# Altium project lpedt_project_board_cubit.PrjPcb (part 4 of 4)

## Sheet Mag_Enc_Sensors.SchDoc
size Letter; SheetNumber: 6; SheetTotal: 8
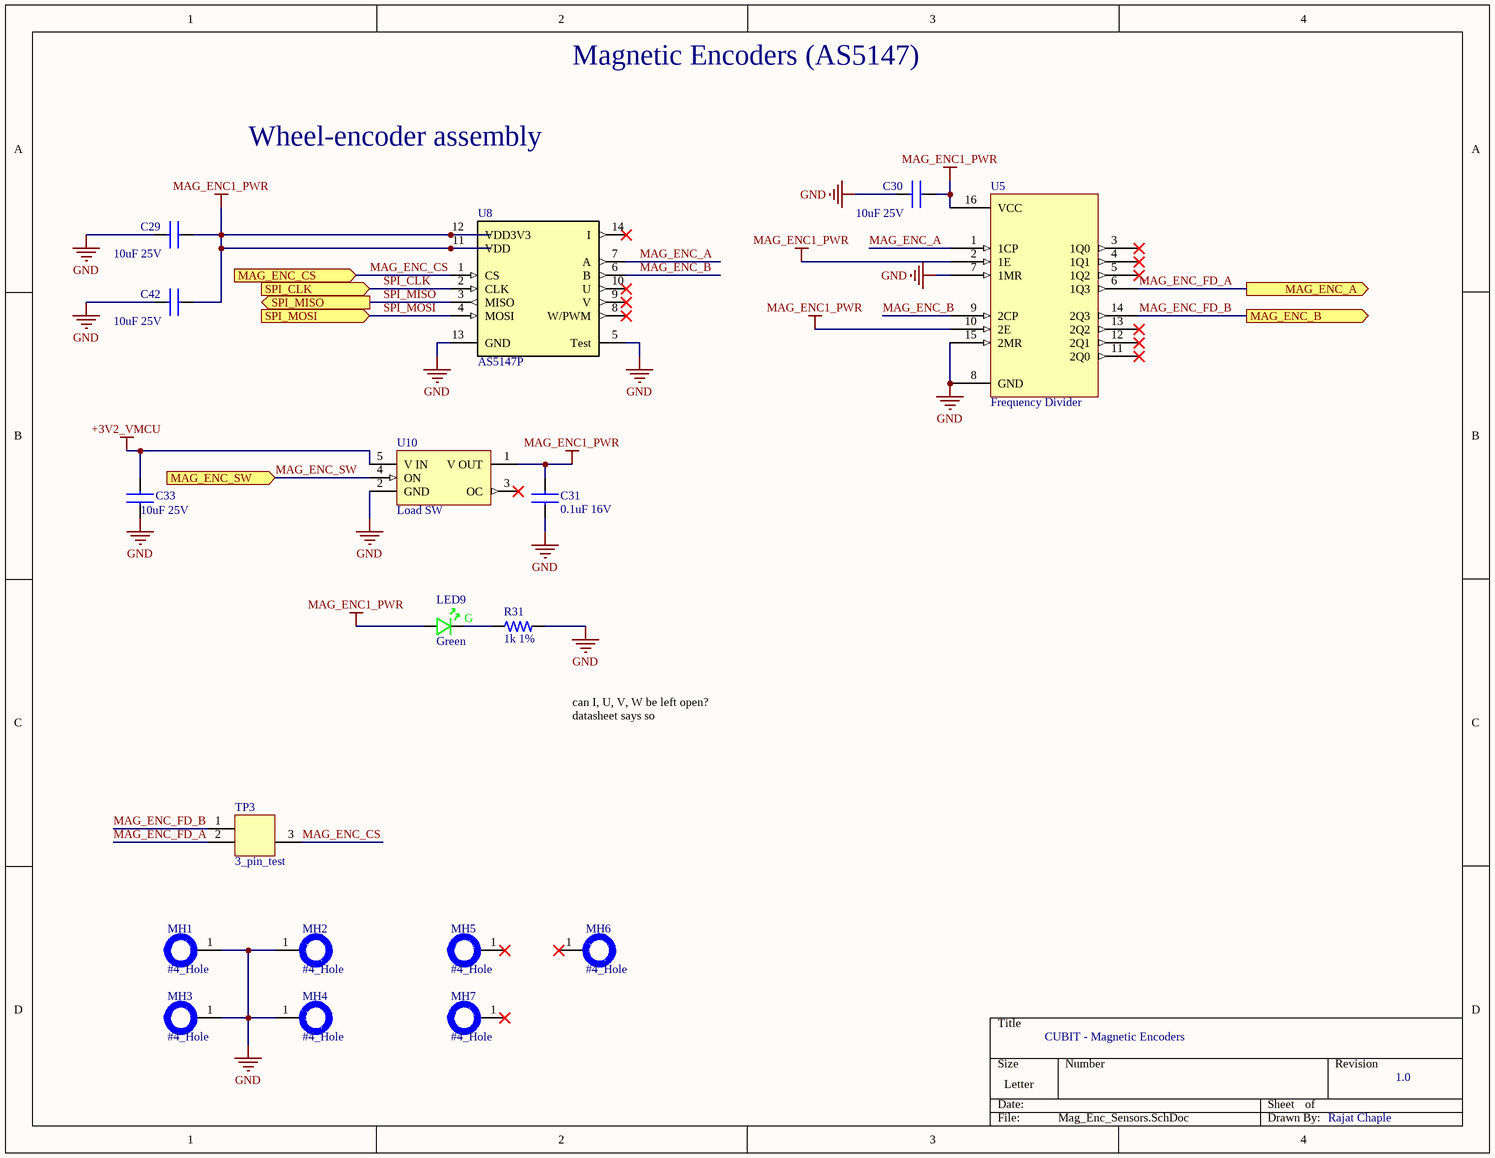
[diagram p5: Mag_Enc_Sensors.SchDoc]

### Parts
C29  10uF 25V  [CAP_0805_02X125]
C30  10uF 25V  [CAP_0805_02X125]
C31  0.1uF 16V  [CAP_0603_1MM]
C33  10uF 25V  [CAP_0805_02X125]
C42  10uF 25V  [CAP_0805_02X125]
LED9  Green  [LED_0603_RED_WL-SMCW]
MH1  #4_Hole  [HOLE_#4]
MH2  #4_Hole  [HOLE_#4]
MH3  #4_Hole  [HOLE_#4]
MH4  #4_Hole  [HOLE_#4]
MH5  #4_Hole  [HOLE_#4]
MH6  #4_Hole  [HOLE_#4]
MH7  #4_Hole  [HOLE_#4]
R31  1k 1%  [2_Chip_0603_RMCF]
TP3  3_pin_test  [3_PIN_100mil]
U5  Frequency Divider  [SOIC127P600X175-16N]
U8  AS5147P  [14-TSOP_5x4_4]
U10  Load SW  [SOT65P210X110-5N]

### Ports
MAG_ENC_A (out), MAG_ENC_B (out), MAG_ENC_CS (in), MAG_ENC_SW (in), SPI_CLK (in), SPI_MISO (out), SPI_MOSI (in)

### Nets
+3V2_VMCU: C33.1 U10.5(V_IN)
GND: C29.2 C30.2 C31.2 C33.2 C42.2 MH1.1 MH2.1 MH3.1 MH4.1 R31.2 U5.7(1MR) U5.8(GND) U5.15(2MR) U8.5(Test) U8.13(GND) U10.2(GND)
MAG_ENC1_PWR: C29.1 C30.1 C31.1 C42.1 LED9.A U5.2(1E) U5.10(2E) U5.16(VCC) U8.11(VDD) U8.12(VDD3V3) U10.1(V_OUT)
MAG_ENC_A: U5.1(1CP) U8.7(A)
MAG_ENC_B: U5.9(2CP) U8.6(B)
MAG_ENC_CS: TP3.3 U8.1(CS) ; port MAG_ENC_CS
MAG_ENC_FD_A: TP3.2 U5.6(1Q3) ; port MAG_ENC_A
MAG_ENC_FD_B: TP3.1 U5.14(2Q3) ; port MAG_ENC_B
MAG_ENC_SW: U10.4(ON) ; port MAG_ENC_SW
SPI_CLK: U8.2(CLK) ; port SPI_CLK
SPI_MISO: U8.3(MISO) ; port SPI_MISO
SPI_MOSI: U8.4(MOSI) ; port SPI_MOSI
NetLED9_C: LED9.C R31.1

Not connected (* = marked no-connect by the designer): MH5 1*; MH6 1*; MH7 1*; U5 3(1Q0)* 4(1Q1)* 5(1Q2)* 11(2Q0)* 12(2Q1)* 13(2Q2)*; U8 8(W/PWM)* 9(V)* 10(U)* 14(I)*; U10 3(OC)*

### Notes on the sheet
- Magnetic Encoders (AS5147)
- Wheel-encoder assembly
- can I, U, V, W be left open?
  datasheet says so
- CUBIT - Magnetic Encoders
- 1.0
- Rajat Chaple
- (in symbol QBLP601-AG1) G

### Library data of the parts
C29 C30 C33 C42 = GRM21BR61E106KA73K: Cap 0805 25 V 10 uF ±20% Tolerance X5R Monolithic Ceramic Chip Capacitor; Manufacturer: Murata; Tolerance: 10%; Supplier 1: Digi-Key; Manufacturer Part Number: GRM21BR61E106KA73K; RoHS: Yes; Category: Ceramic Capacitors; Stock 1: 1875; Pricing 1: 1=0.23000, 10=0.15700, 50=0.09400, 100=0.07940, 500=0.05434, 1000=0.04807, 2500=0.04598, 5000=0.04180 (USD); Mount: Surface Mount; Case/Package: 0805; Weight: 0.000335oz; Min Operating Temperature: -55°C; Max Operating Temperature: 85°C; Packaging: Tape and Reel; Capacitance: 10uF; Voltage Rating: 25V; Package Quantity: 10000; Dielectric: X5R; Voltage Rating (DC): 25V; Length: 0.079inch; Width: 0.049inch; Thickness: 0.055inch; RoHS Compliant: Yes; ComponentLink1URL: http://www.mouser.com/ds/2/281/c02e-2905.pdf?src-supplier=Mouser; ComponentLink1Description: http://www.mouser.com/ds/2/281/c02e-2905.pdf?src-supplier=Mouser; ComponentLink2URL: http://search.murata.co.jp/Ceramy/image/img/A01X/G101/ENG/GRM21BR61E106KA73-01.pdf?src-supplier=Digi-Key; ComponentLink2Description: http://search.murata.co.jp/Ceramy/image/img/A01X/G101/ENG/GRM21BR61E106KA73-01.pdf?src-supplier=Digi-Key; ComponentLink3URL: https://search.murata.co.jp/Ceramy/image/img/A01X/G101/ENG/GRM21BR61E106KA73-01.pdf?src-supplier=Digi-Key; ComponentLink3Description: https://search.murata.co.jp/Ceramy/image/img/A01X/G101/ENG/GRM21BR61E106KA73-01.pdf?src-supplier=Digi-Key
C31 = C0805C104K4RACAUTO: Cap Ceramic 0.1uF 16V X7R 10% SMD 0603 125°C Paper T/R; Manufacturer: KEMET; Capacitance: 100nF; Supplier 1: Digi-Key; Manufacturer Part Number: C0805C104K4RACAUTO; RoHS: Yes; Category: Ceramic Capacitors; Stock 1: 15900; Pricing 1: 1=0.24000, 10=0.16200, 50=0.09700, 100=0.08190, 500=0.05606, 1000=0.04959 (USD); Case/Package: 0805; Min Operating Temperature: -55°C; Max Operating Temperature: 125°C; Tolerance: 10%; Packaging: Tape and Reel; Dielectric: X7R; Length: 2mm; Depth: 1.25mm; RoHS Compliant: Yes; ComponentLink1URL: http://components.arrow.com/part/dataview/0323_00325188?src-supplier=Arrow+Europe; ComponentLink1Description: http://components.arrow.com/part/dataview/0323_00325188?src-supplier=Arrow+Europe
LED9 = QBLP601-AG1: Led Green Clear 0603 SMD; Manufacturer: QT-Brightek; Supplier 1: Digi-Key; Manufacturer Part Number: QBLP601-AG1; RoHS: No; Stock 1: 5990; Pricing 1: 1=0.35000, 10=0.19000, 100=0.08820, 500=0.08140, 1000=0.06377, 2000=0.06242 (USD)
MH1-MH7 = Mechanical_Hole
R31 = RMCF0603FT1K00: Res 1K Ohm 1% 0.1W(1/10W) ±100ppm/C Pad SMD Automotive T/R; Manufacturer: Stackpole Electronics; Resistance: 1kR; Power Rating: 100mW; Temperature Coefficient: 100ppm/°C; Supplier 1: Digi-Key; Manufacturer Part Number: RMCF0603FT1K00; RoHS: Yes; Category: Chip SMD Resistors; Pricing 1: 1=0.10000, 10=0.01700, 100=0.00680, 1000=0.00305, 2500=0.00264 (USD); Mount: Surface Mount; Case/Package: 0603; Case Code (Metric): 1608; Case Code (Imperial): 0603; Contact Plating: Tin,Matte; Size Code: 0603; Min Operating Temperature: -55°C; Max Operating Temperature: 155°C; Tolerance: 1%; Packaging: Tape and Reel; Resistor Type: Thick Film; Number of Terminations: 2; Max Power Dissipation: 100mW; Features: Automotive AEC-Q200; Series: RMCF; Construction: Rectangular; Length: 1.55mm; Width: 0.031inch; Height: 0.022inch; Depth: 0.8mm; Radiation Hardening: No; Military Standard: Not; Lead Free: Lead Free; RoHS Compliant: Yes; ComponentLink1URL: https://www.seielect.com/catalog/sei-rmcf_rmcp.pdf?src-supplier=Digi-Key; ComponentLink1Description: https://www.seielect.com/catalog/sei-rmcf_rmcp.pdf?src-supplier=Digi-Key; ComponentLink2URL: https://www.seielect.com/catalog/SEI-RMCF_RMCP.pdf?src-supplier=Avnet; ComponentLink2Description: https://www.seielect.com/catalog/SEI-RMCF_RMCP.pdf?src-supplier=Avnet; ComponentLink3URL: https://www.seielect.com/catalog/SEI-Packaging.pdf?src-supplier=Avnet; ComponentLink3Description: https://www.seielect.com/catalog/SEI-Packaging.pdf?src-supplier=Avnet; ComponentLink4URL: https://www.seielect.com/catalog/SEI-Packaging.pdf?src-supplier=Arrow+Electronics; ComponentLink4Description: https://www.seielect.com/catalog/SEI-Packaging.pdf?src-supplier=Arrow+Electronics; ComponentLink5URL: https://www.seielect.com/catalog/SEI-RMCF_RMCP.pdf?src-supplier=Avnet+Asia; ComponentLink5Description: https://www.seielect.com/catalog/SEI-RMCF_RMCP.pdf?src-supplier=Avnet+Asia; ComponentLink6URL: http://www.seielect.com/Catalog/SEI-rmc.pdf?src-supplier=Future+Electronics; ComponentLink6Description: http://www.seielect.com/Catalog/SEI-rmc.pdf?src-supplier=Future+Electronics; ComponentLink7URL: https://www.seielect.com/catalog/SEI-Packaging.pdf?src-supplier=Verical; ComponentLink7Description: https://www.seielect.com/catalog/SEI-Packaging.pdf?src-supplier=Verical; ComponentLink8URL: https://www.seielect.com/catalog/SEI-Packaging.pdf?src-supplier=Quest; ComponentLink8Description: https://www.seielect.com/catalog/SEI-Packaging.pdf?src-supplier=Quest
U5 = CD74HC4520M96: CD74HC4520 High Speed Cmos Logic; Manufacturer: Texas Instruments; Max Supply Voltage: 6V; Min Supply Voltage: 2V; Propagation Delay: 360ns; Number of Elements: 2; Direction: Up,Unidirectional; Number of Bits per Element: 4; Reset: Asynchronous; Logic Function: Counter; Frequency: 60MHz; Sync/Async: Synchronous; Quiescent Current: 8uA; Supplier 1: Digi-Key; Manufacturer Part Number: CD74HC4520M96; RoHS: Yes; Category: Counters; Stock 1: 5254; Pricing 1: 1=0.64000, 10=0.56200, 25=0.52800, 100=0.43090, 250=0.40028, 500=0.34066, 1000=0.28121 (USD); Mount: Surface Mount; Case/Package: SOIC; Number of Pins: 16; Weight: 0.004998oz; Contact Plating: Gold; Min Operating Temperature: -55°C; Max Operating Temperature: 125°C; Packaging: Tape and Reel; Package Quantity: 2500; Number of Bits: 4; Turn-On Delay Time: 360ns; Series: 74HC; Technology: CMOS; Length: 9.9mm; Width: 3.91mm; Height: 1.58mm; Radiation Hardening: No; REACH SVHC: No SVHC; Lead Free: Lead Free; RoHS Compliant: Yes; ComponentLink1URL: https://datasheet.ciiva.com/15093/getdatasheetpartid-248732-15093616.pdf?src-supplier=Verical; ComponentLink1Description: https://datasheet.ciiva.com/15093/getdatasheetpartid-248732-15093616.pdf?src-supplier=Verical; ComponentLink2URL: https://datasheet.ciiva.com/14295/cd74hc4520-14295753.pdf?src-supplier=Avnet; ComponentLink2Description: https://datasheet.ciiva.com/14295/cd74hc4520-14295753.pdf?src-supplier=Avnet; ComponentLink3URL: https://datasheet.ciiva.com/26209/cd54hc4520-26209833.pdf?src-supplier=Avnet+Europe; ComponentLink3Description: https://datasheet.ciiva.com/26209/cd54hc4520-26209833.pdf?src-supplier=Avnet+Europe; ComponentLink4URL: https://datasheet.ciiva.com/41455/001015795-da-01-en-ic-dual-bcd-up-cd74hc4520m96-soic-16-tid-41455754.pdf?src-supplier=Conrad; ComponentLink4Description: https://datasheet.ciiva.com/41455/001015795-da-01-en-ic-dual-bcd-up-cd74hc4520m96-soic-16-tid-41455754.pdf?src-supplier=Conrad
U8 = AS5147P-HTSM: Rotary Position Sensor 5.5V/3.6V Digital Output Automotive 14-Pin TSSOP T/R; Manufacturer: ams; Encoder Type: Magnetic; Detent: No; Output Type: PWM,Quadrature,Incremental,Commutation,SPI; Supplier 1: Digi-Key; Manufacturer Part Number: AS5147P-HTSM; RoHS: Yes; Category: Integrated Circuits (ICs); Mount: Surface Mount; Termination: SMD/SMT; Built in Switch: No; Lead Free: Lead Free; RoHS Compliant: Yes; ComponentLink1URL: http://ams.com/documents/20143/36005/AS5147P_FS000142_1-00.pdf?src-supplier=Digi-Key; ComponentLink1Description: http://ams.com/documents/20143/36005/AS5147P_FS000142_1-00.pdf?src-supplier=Digi-Key; ComponentLink2URL: https://ams.com/documents/20143/36005/AS5147P_FS000142_1-00.pdf?src-supplier=Digi-Key; ComponentLink2Description: https://ams.com/documents/20143/36005/AS5147P_FS000142_1-00.pdf?src-supplier=Digi-Key; ComponentLink3URL: http://ams.com/eng/content/download/752969/1908315/394215?src-supplier=Digi-Key; ComponentLink3Description: http://ams.com/eng/content/download/752969/1908315/394215?src-supplier=Digi-Key
U10 = TPS22942DCKR: 5.5-V, 0.1-A, 500-mΩ, load switch with current limit and active low enable 5-SC70 -40 to 85; Manufacturer: Texas Instruments; Number of Outputs: 1; Output Current: 200mA; Nominal Supply Current: 1uA; Max Output Current: 100mA; Max Supply Voltage: 5.5V; Min Supply Voltage: 1.62V; Interface: On/Off; On-State Resistance: 500mR; Turn-On Delay Time: 60us; Turn-Off Delay Time: 30us; Max Supply Current: 80uA; Max Power Dissipation: 1.22mW; Quiescent Current: 40uA; Fault Protection: Over Temperature; Output Configuration: High Side; Supplier 1: Digi-Key; Manufacturer Part Number: TPS22942DCKR; RoHS: Yes; Category: Hot Swap Controllers; Stock 1: 1111; Pricing 1: 1=1.24000, 10=1.10700, 25=1.05080, 100=0.86310, 250=0.80676, 500=0.71296, 1000=0.61950 (USD); Case/Package: SC; Number of Pins: 5; Weight: 8.8E-05oz; Min Operating Temperature: -40°C; Max Operating Temperature: 85°C; Packaging: Tape and Reel; Number of Inputs: 1; Package Quantity: 3000; Max Input Voltage: 5.5V; Min Input Voltage: 1.62V; Termination: SMD/SMT; Min Current Limit: 100mA; Number of Channels: 1; Radiation Hardening: No; REACH SVHC: No SVHC; Lead Free: Lead Free; RoHS Compliant: Yes; ComponentLink1URL: https://datasheet.ciiva.com/1962/tps22945-1962436.pdf?src-supplier=Digi-Key; ComponentLink1Description: https://datasheet.ciiva.com/1962/tps22945-1962436.pdf?src-supplier=Digi-Key; ComponentLink2URL: https://datasheet.ciiva.com/15103/getdatasheetpartid-122296-15103873.pdf?src-supplier=Verical; ComponentLink2Description: https://datasheet.ciiva.com/15103/getdatasheetpartid-122296-15103873.pdf?src-supplier=Verical; ComponentLink3URL: https://datasheet.ciiva.com/1512/1840307-1512708.pdf?src-supplier=Element14; ComponentLink3Description: https://datasheet.ciiva.com/1512/1840307-1512708.pdf?src-supplier=Element14; ComponentLink4URL: https://datasheet.ciiva.com/1963/tps22942-1963503.pdf?src-supplier=Digi-Key; ComponentLink4Description: https://datasheet.ciiva.com/1963/tps22942-1963503.pdf?src-supplier=Digi-Key; ComponentLink5URL: https://datasheet.ciiva.com/1963/tps22942-1963502.pdf?src-supplier=Digi-Key; ComponentLink5Description: https://datasheet.ciiva.com/1963/tps22942-1963502.pdf?src-supplier=Digi-Key; ComponentLink6URL: https://datasheet.ciiva.com/3233/tps22945-3233582.pdf?src-supplier=Avnet; ComponentLink6Description: https://datasheet.ciiva.com/3233/tps22945-3233582.pdf?src-supplier=Avnet; ComponentLink7URL: https://datasheet.ciiva.com/26074/tps22945-26074375.pdf?src-supplier=Avnet+Europe; ComponentLink7Description: https://datasheet.ciiva.com/26074/tps22945-26074375.pdf?src-supplier=Avnet+Europe

## Sheet ultrasonic_imu_sensor.SchDoc
size A; SheetNumber: 7; SheetTotal: 8
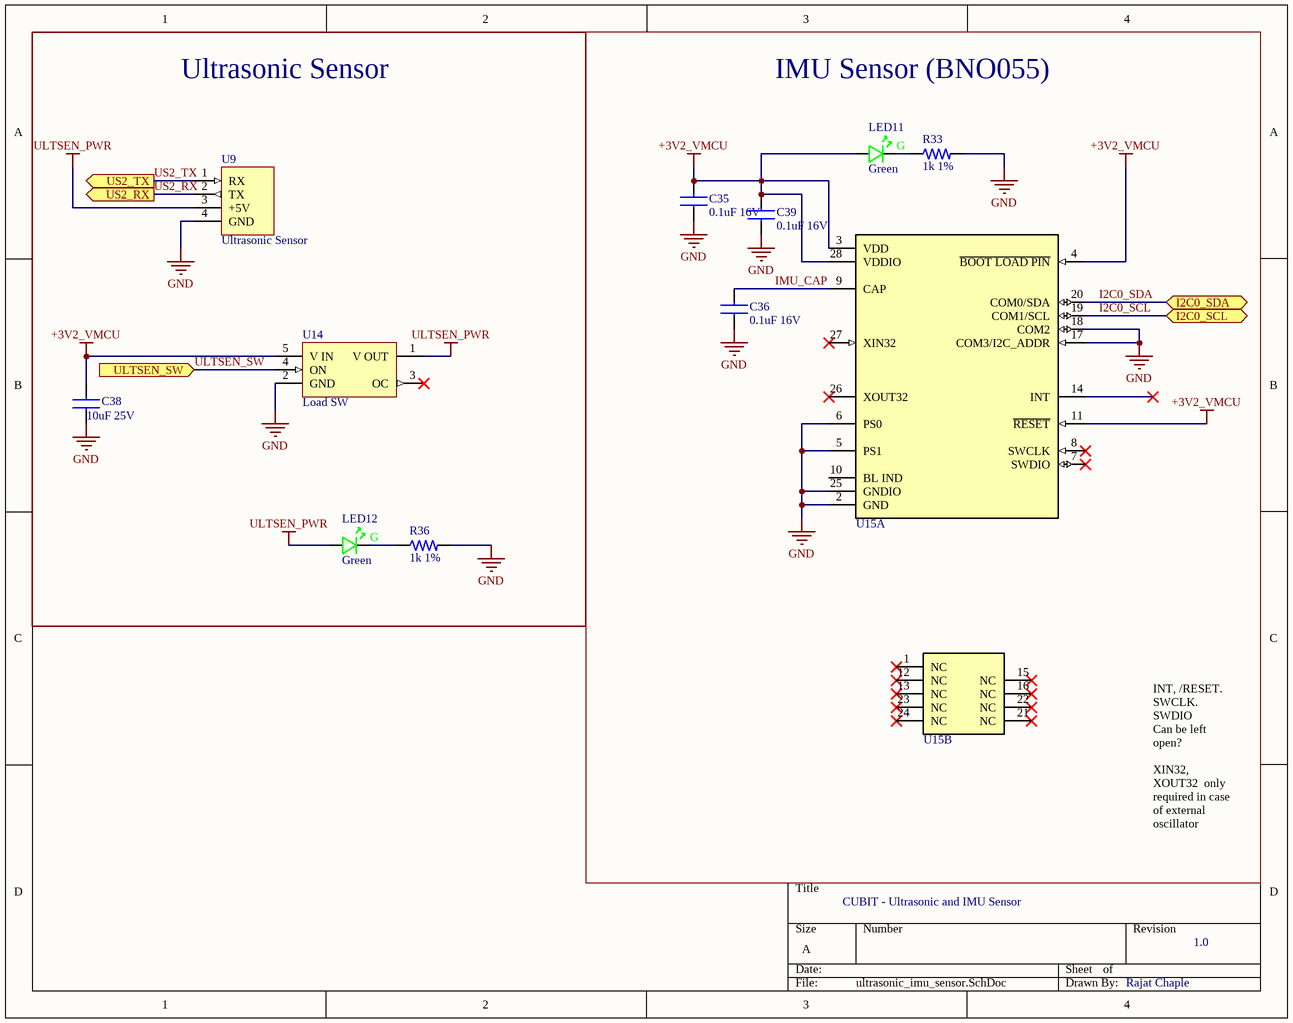
[diagram p6: ultrasonic_imu_sensor.SchDoc]

### Parts
C35  0.1uF 16V  [CAP_0603_1MM]
C36  0.1uF 16V  [CAP_0603_1MM]
C38  10uF 25V  [CAP_0805_02X125]
C39  0.1uF 16V  [CAP_0603_1MM]
LED11  Green  [LED_0603_RED_WL-SMCW]
LED12  Green  [LED_0603_RED_WL-SMCW]
R33  1k 1%  [2_Chip_0603_RMCF]
R36  1k 1%  [2_Chip_0603_RMCF]
U9  Ultrasonic Sensor  [4_PIN_100MIL]
U14  Load SW  [SOT65P210X110-5N]
U15  BNO005  [LGA28R50P4X10_380X520X100]  (value not drawn)  (parts A,B of 2)

### Blocks framed on the sheet
Ultrasonic Sensor: C38 LED12 R36 U9 U14
IMU Sensor (BNO055): C35 C36 C39 LED11 R33 U15

### Ports
I2C0_SCL (bidir), I2C0_SDA (bidir), ULTSEN_SW (in), US2_RX (out), US2_TX (out)

### Nets
+3V2_VMCU: C35.1 C38.1 C39.1 LED11.A U14.5(V_IN) U15.3(VDD) U15.4(~{BOOT_LOAD_PIN}) U15.11(~{RESET}) U15.28(VDDIO)
GND: C35.2 C36.2 C38.2 C39.2 R33.2 R36.2 U9.4(GND) U14.2(GND) U15.2(GND) U15.5(PS1) U15.6(PS0) U15.17(COM3/I2C_ADDR) U15.18(COM2) U15.25(GNDIO)
ULTSEN_PWR: LED12.A U9.3(+5V) U14.1(V_OUT)
I2C0_SCL: U15.19(COM1/SCL) ; port I2C0_SCL
I2C0_SDA: U15.20(COM0/SDA) ; port I2C0_SDA
IMU_CAP: C36.1 U15.9(CAP)
ULTSEN_SW: U14.4(ON) ; port ULTSEN_SW
US2_RX: U9.2(TX) ; port US2_RX
US2_TX: U9.1(RX) ; port US2_TX
NetLED11_C: LED11.C R33.1
NetLED12_C: LED12.C R36.1

Not connected (* = marked no-connect by the designer): U14 3(OC)*; U15 1(NC)* 7(SWDIO)* 8(SWCLK)* 10(BL_IND) 12(NC)* 13(NC)* 14(INT)* 15(NC)* 16(NC)* 21(NC)* 22(NC)* 23(NC)* 24(NC)* 26(XOUT32)* 27(XIN32)*

### Notes on the sheet
- INT, /RESET. SWCLK. SWDIO
  Can be left open?
  XIN32, XOUT32  only required in case of external oscillator
- CUBIT - Ultrasonic and IMU Sensor
- 1.0
- Rajat Chaple
- (in symbol QBLP601-AG1) G

### Library data of the parts
C35 C36 C39 = C0805C104K4RACAUTO: as C31 on sheet Mag_Enc_Sensors; Supplier 1: Digi-Key; Manufacturer Part Number: C0805C104K4RACAUTO; RoHS: Yes; Category: Ceramic Capacitors; Stock 1: 15900; Pricing 1: 1=0.24000, 10=0.16200, 50=0.09700, 100=0.08190, 500=0.05606, 1000=0.04959 (USD); Case/Package: 0805; Min Operating Temperature: -55°C; Max Operating Temperature: 125°C; Tolerance: 10%; Packaging: Tape and Reel; Dielectric: X7R; Length: 2mm; Depth: 1.25mm; RoHS Compliant: Yes; ComponentLink1URL: http://components.arrow.com/part/dataview/0323_00325188?src-supplier=Arrow+Europe; ComponentLink1Description: http://components.arrow.com/part/dataview/0323_00325188?src-supplier=Arrow+Europe
C38 = GRM21BR61E106KA73K: as C29 on sheet Mag_Enc_Sensors; Supplier 1: Digi-Key; Manufacturer Part Number: GRM21BR61E106KA73K; RoHS: Yes; Category: Ceramic Capacitors; Stock 1: 1875; Pricing 1: 1=0.23000, 10=0.15700, 50=0.09400, 100=0.07940, 500=0.05434, 1000=0.04807, 2500=0.04598, 5000=0.04180 (USD); Mount: Surface Mount; Case/Package: 0805; Weight: 0.000335oz; Min Operating Temperature: -55°C; Max Operating Temperature: 85°C; Packaging: Tape and Reel; Capacitance: 10uF; Voltage Rating: 25V; Package Quantity: 10000; Dielectric: X5R; Voltage Rating (DC): 25V; Length: 0.079inch; Width: 0.049inch; Thickness: 0.055inch; RoHS Compliant: Yes; ComponentLink1URL: http://www.mouser.com/ds/2/281/c02e-2905.pdf?src-supplier=Mouser; ComponentLink1Description: http://www.mouser.com/ds/2/281/c02e-2905.pdf?src-supplier=Mouser; ComponentLink2URL: http://search.murata.co.jp/Ceramy/image/img/A01X/G101/ENG/GRM21BR61E106KA73-01.pdf?src-supplier=Digi-Key; ComponentLink2Description: http://search.murata.co.jp/Ceramy/image/img/A01X/G101/ENG/GRM21BR61E106KA73-01.pdf?src-supplier=Digi-Key; ComponentLink3URL: https://search.murata.co.jp/Ceramy/image/img/A01X/G101/ENG/GRM21BR61E106KA73-01.pdf?src-supplier=Digi-Key; ComponentLink3Description: https://search.murata.co.jp/Ceramy/image/img/A01X/G101/ENG/GRM21BR61E106KA73-01.pdf?src-supplier=Digi-Key
LED11 LED12 = QBLP601-AG1: as LED9 on sheet Mag_Enc_Sensors; Supplier 1: Digi-Key; Manufacturer Part Number: QBLP601-AG1; RoHS: No; Stock 1: 5990; Pricing 1: 1=0.35000, 10=0.19000, 100=0.08820, 500=0.08140, 1000=0.06377, 2000=0.06242 (USD)
R33 R36 = RMCF0603FT1K00: as R31 on sheet Mag_Enc_Sensors; Supplier 1: Digi-Key; Manufacturer Part Number: RMCF0603FT1K00; RoHS: Yes; Category: Chip SMD Resistors; Pricing 1: 1=0.10000, 10=0.01700, 100=0.00680, 1000=0.00305, 2500=0.00264 (USD); Mount: Surface Mount; Case/Package: 0603; Case Code (Metric): 1608; Case Code (Imperial): 0603; Contact Plating: Tin,Matte; Size Code: 0603; Min Operating Temperature: -55°C; Max Operating Temperature: 155°C; Tolerance: 1%; Packaging: Tape and Reel; Resistor Type: Thick Film; Number of Terminations: 2; Max Power Dissipation: 100mW; Features: Automotive AEC-Q200; Series: RMCF; Construction: Rectangular; Length: 1.55mm; Width: 0.031inch; Height: 0.022inch; Depth: 0.8mm; Radiation Hardening: No; Military Standard: Not; Lead Free: Lead Free; RoHS Compliant: Yes; ComponentLink1URL: https://www.seielect.com/catalog/sei-rmcf_rmcp.pdf?src-supplier=Digi-Key; ComponentLink1Description: https://www.seielect.com/catalog/sei-rmcf_rmcp.pdf?src-supplier=Digi-Key; ComponentLink2URL: https://www.seielect.com/catalog/SEI-RMCF_RMCP.pdf?src-supplier=Avnet; ComponentLink2Description: https://www.seielect.com/catalog/SEI-RMCF_RMCP.pdf?src-supplier=Avnet; ComponentLink3URL: https://www.seielect.com/catalog/SEI-Packaging.pdf?src-supplier=Avnet; ComponentLink3Description: https://www.seielect.com/catalog/SEI-Packaging.pdf?src-supplier=Avnet; ComponentLink4URL: https://www.seielect.com/catalog/SEI-Packaging.pdf?src-supplier=Arrow+Electronics; ComponentLink4Description: https://www.seielect.com/catalog/SEI-Packaging.pdf?src-supplier=Arrow+Electronics; ComponentLink5URL: https://www.seielect.com/catalog/SEI-RMCF_RMCP.pdf?src-supplier=Avnet+Asia; ComponentLink5Description: https://www.seielect.com/catalog/SEI-RMCF_RMCP.pdf?src-supplier=Avnet+Asia; ComponentLink6URL: http://www.seielect.com/Catalog/SEI-rmc.pdf?src-supplier=Future+Electronics; ComponentLink6Description: http://www.seielect.com/Catalog/SEI-rmc.pdf?src-supplier=Future+Electronics; ComponentLink7URL: https://www.seielect.com/catalog/SEI-Packaging.pdf?src-supplier=Verical; ComponentLink7Description: https://www.seielect.com/catalog/SEI-Packaging.pdf?src-supplier=Verical; ComponentLink8URL: https://www.seielect.com/catalog/SEI-Packaging.pdf?src-supplier=Quest; ComponentLink8Description: https://www.seielect.com/catalog/SEI-Packaging.pdf?src-supplier=Quest
U14 = TPS22942DCKR: as U10 on sheet Mag_Enc_Sensors; Supplier 1: Digi-Key; Manufacturer Part Number: TPS22942DCKR; RoHS: Yes; Category: Hot Swap Controllers; Stock 1: 1111; Pricing 1: 1=1.24000, 10=1.10700, 25=1.05080, 100=0.86310, 250=0.80676, 500=0.71296, 1000=0.61950 (USD); Case/Package: SC; Number of Pins: 5; Weight: 8.8E-05oz; Min Operating Temperature: -40°C; Max Operating Temperature: 85°C; Packaging: Tape and Reel; Number of Inputs: 1; Package Quantity: 3000; Max Input Voltage: 5.5V; Min Input Voltage: 1.62V; Termination: SMD/SMT; Min Current Limit: 100mA; Number of Channels: 1; Radiation Hardening: No; REACH SVHC: No SVHC; Lead Free: Lead Free; RoHS Compliant: Yes; ComponentLink1URL: https://datasheet.ciiva.com/1962/tps22945-1962436.pdf?src-supplier=Digi-Key; ComponentLink1Description: https://datasheet.ciiva.com/1962/tps22945-1962436.pdf?src-supplier=Digi-Key; ComponentLink2URL: https://datasheet.ciiva.com/15103/getdatasheetpartid-122296-15103873.pdf?src-supplier=Verical; ComponentLink2Description: https://datasheet.ciiva.com/15103/getdatasheetpartid-122296-15103873.pdf?src-supplier=Verical; ComponentLink3URL: https://datasheet.ciiva.com/1512/1840307-1512708.pdf?src-supplier=Element14; ComponentLink3Description: https://datasheet.ciiva.com/1512/1840307-1512708.pdf?src-supplier=Element14; ComponentLink4URL: https://datasheet.ciiva.com/1963/tps22942-1963503.pdf?src-supplier=Digi-Key; ComponentLink4Description: https://datasheet.ciiva.com/1963/tps22942-1963503.pdf?src-supplier=Digi-Key; ComponentLink5URL: https://datasheet.ciiva.com/1963/tps22942-1963502.pdf?src-supplier=Digi-Key; ComponentLink5Description: https://datasheet.ciiva.com/1963/tps22942-1963502.pdf?src-supplier=Digi-Key; ComponentLink6URL: https://datasheet.ciiva.com/3233/tps22945-3233582.pdf?src-supplier=Avnet; ComponentLink6Description: https://datasheet.ciiva.com/3233/tps22945-3233582.pdf?src-supplier=Avnet; ComponentLink7URL: https://datasheet.ciiva.com/26074/tps22945-26074375.pdf?src-supplier=Avnet+Europe; ComponentLink7Description: https://datasheet.ciiva.com/26074/tps22945-26074375.pdf?src-supplier=Avnet+Europe
U15 = BNO055

## Sheet solar_cell.SchDoc
size A; SheetNumber: 8; SheetTotal: 8
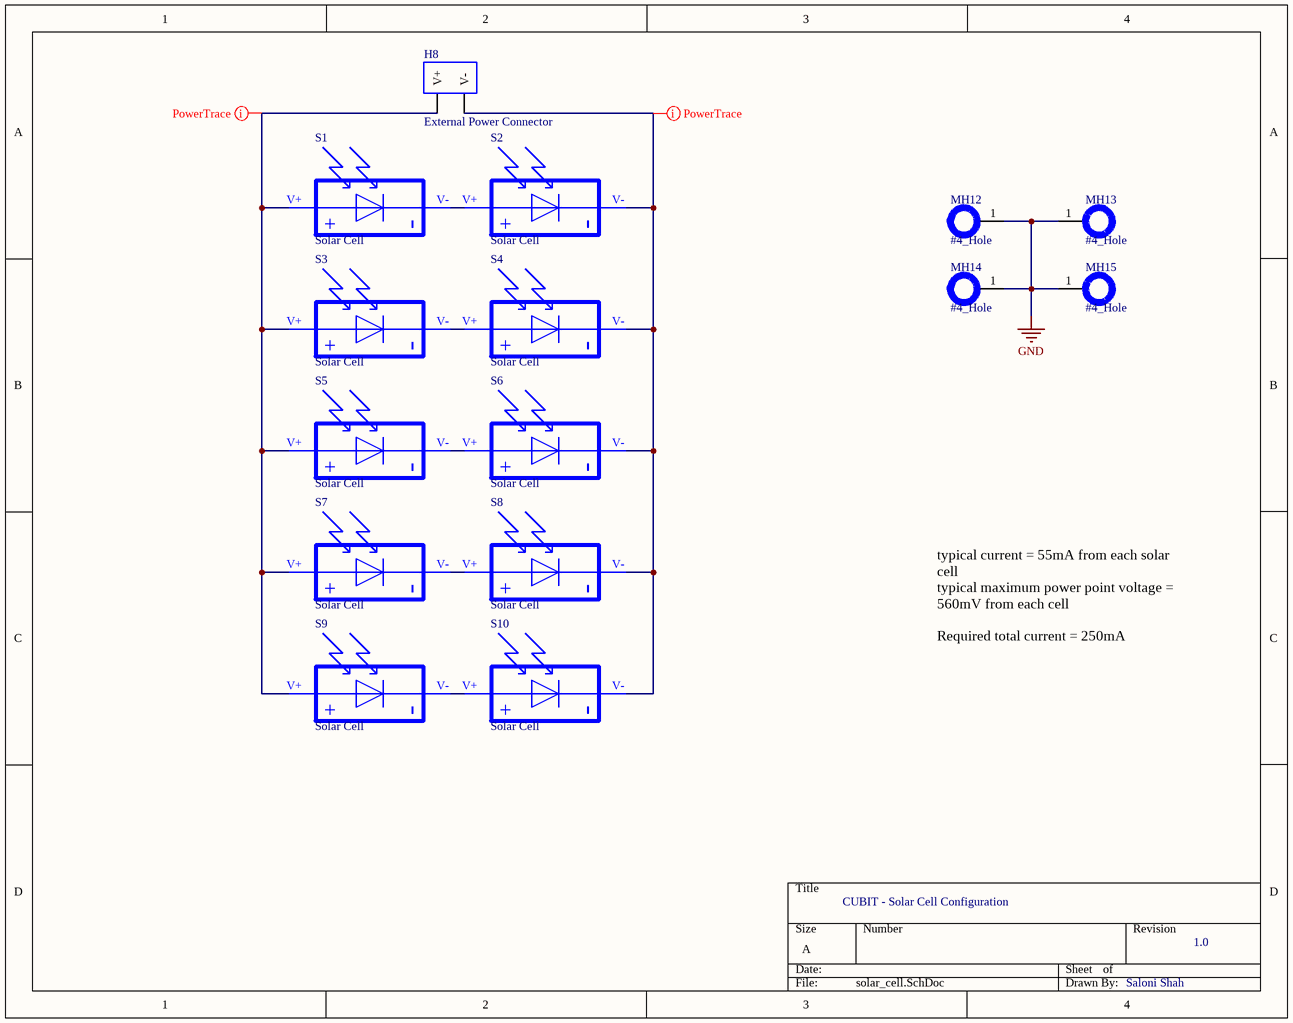
[diagram p7: solar_cell.SchDoc]

### Parts
H8  External Power Connector  [2_PIN_100mil]
MH12  #4_Hole  [HOLE_#4]
MH13  #4_Hole  [HOLE_#4]
MH14  #4_Hole  [HOLE_#4]
MH15  #4_Hole  [HOLE_#4]
S1  Solar Cell  [KXOB25-14X1F]
S2  Solar Cell  [KXOB25-14X1F]
S3  Solar Cell  [KXOB25-14X1F]
S4  Solar Cell  [KXOB25-14X1F]
S5  Solar Cell  [KXOB25-14X1F]
S6  Solar Cell  [KXOB25-14X1F]
S7  Solar Cell  [KXOB25-14X1F]
S8  Solar Cell  [KXOB25-14X1F]
S9  Solar Cell  [KXOB25-14X1F]
S10  Solar Cell  [KXOB25-14X1F]

### Nets
GND: MH12.1 MH13.1 MH14.1 MH15.1
NetH8_1: H8.1(V+) S1.V+ S3.V+ S5.V+ S7.V+ S9.V+
NetH8_2: H8.2(V-) S2.V- S4.V- S6.V- S8.V- S10.V-
NetS1_V-: S1.V- S2.V+
NetS3_V-: S3.V- S4.V+
NetS5_V-: S5.V- S6.V+
NetS7_V-: S7.V- S8.V+
NetS9_V-: S9.V- S10.V+

### Layout directives
rule Width Constraint [Pref Width = 20mil    Min Width = 20mil    Max Width = 100mil]: NetH8_1, NetH8_2

### Notes on the sheet
- typical current = 55mA from each solar cell
  typical maximum power point voltage = 560mV from each cell
  Required total current = 250mA
- CUBIT - Solar Cell Configuration
- 1.0
- Saloni Shah
- (in symbol KXOB25-14X1F) +; -

### Library data of the parts
H8 = ext_pwr_conn
MH12-MH15 = Mechanical_Hole
S1-S10 = KXOB25-14X1F: MONOCRYS SOLAR CELL 30.7MW 690MV; MF: ANYSOLAR Ltd; Price: None; MP: KXOB25-14X1F; Availability: Bad; SnapEDA_Link: https://www.snapeda.com/parts/KXOB25-14X1F/Sola/view-part/5163586/?ref=snap; Value: *; Package: None; Check_prices: https://www.snapeda.com/parts/KXOB25-14X1F/Sola/view-part/5163586/?ref=eda

## Nets that join several sheets
+1V8_DCDC: efr32_ioport (U3.46), efr32_radio_interface (6 pins)
+3V2_VMCU: efr32_lcd_hmi (C2.1 U1.5), efr32_ioport (6 pins), efr32_radio_interface (6 pins), power_management (H6.2 LED8.A), Mag_Enc_Sensors (C33.1 U10.5), ultrasonic_imu_sensor (9 pins)
GND: efr32_lcd_hmi (18 pins), efr32_ioport (7 pins), efr32_radio_interface (23 pins), power_management (33 pins), Mag_Enc_Sensors (16 pins), ultrasonic_imu_sensor (14 pins), solar_cell (MH12.1 MH13.1 MH14.1 MH15.1)
BRD_Reset: efr32_ioport (R12.1), efr32_radio_interface (C20.1 SW5.1 SW5.2 U3.12)
I2C0_SCL: efr32_ioport (R13.2 TP1.2 U3.48), ultrasonic_imu_sensor (U15.19)
I2C0_SDA: efr32_ioport (R1.2 TP1.1 U3.47), ultrasonic_imu_sensor (U15.20)
LCD_CS: efr32_lcd_hmi (LCD1.5), efr32_ioport (U3.32)
LCD_EXTCOM: efr32_lcd_hmi (LCD1.6), efr32_ioport (U3.33)
LCD_SW: efr32_lcd_hmi (U1.4), efr32_ioport (U3.29)
MAG_ENC_CS: efr32_ioport (U3.21), Mag_Enc_Sensors (TP3.3 U8.1)
MAG_ENC_FD_A: efr32_ioport (U3.22), Mag_Enc_Sensors (TP3.2 U5.6)
MAG_ENC_FD_B: efr32_ioport (U3.23), Mag_Enc_Sensors (TP3.1 U5.14)
MAG_ENC_SW: efr32_ioport (U3.20), Mag_Enc_Sensors (U10.4)
SPI_CLK: efr32_lcd_hmi (LCD1.3), efr32_ioport (TP2.1 U3.45), Mag_Enc_Sensors (U8.2)
SPI_MISO: efr32_ioport (TP2.2 U3.44), Mag_Enc_Sensors (U8.3)
SPI_MOSI: efr32_lcd_hmi (LCD1.4), efr32_ioport (TP2.3 U3.43), Mag_Enc_Sensors (U8.4)
ULTSEN_SW: efr32_ioport (U3.31), ultrasonic_imu_sensor (U14.4)
US2_RX: efr32_ioport (U3.30), ultrasonic_imu_sensor (U9.2)
US2_TX: efr32_ioport (U3.8), ultrasonic_imu_sensor (U9.1)